# EAGLE schematic 96Boards-IoT-Mezzanine (EAGLE 9.6.2)
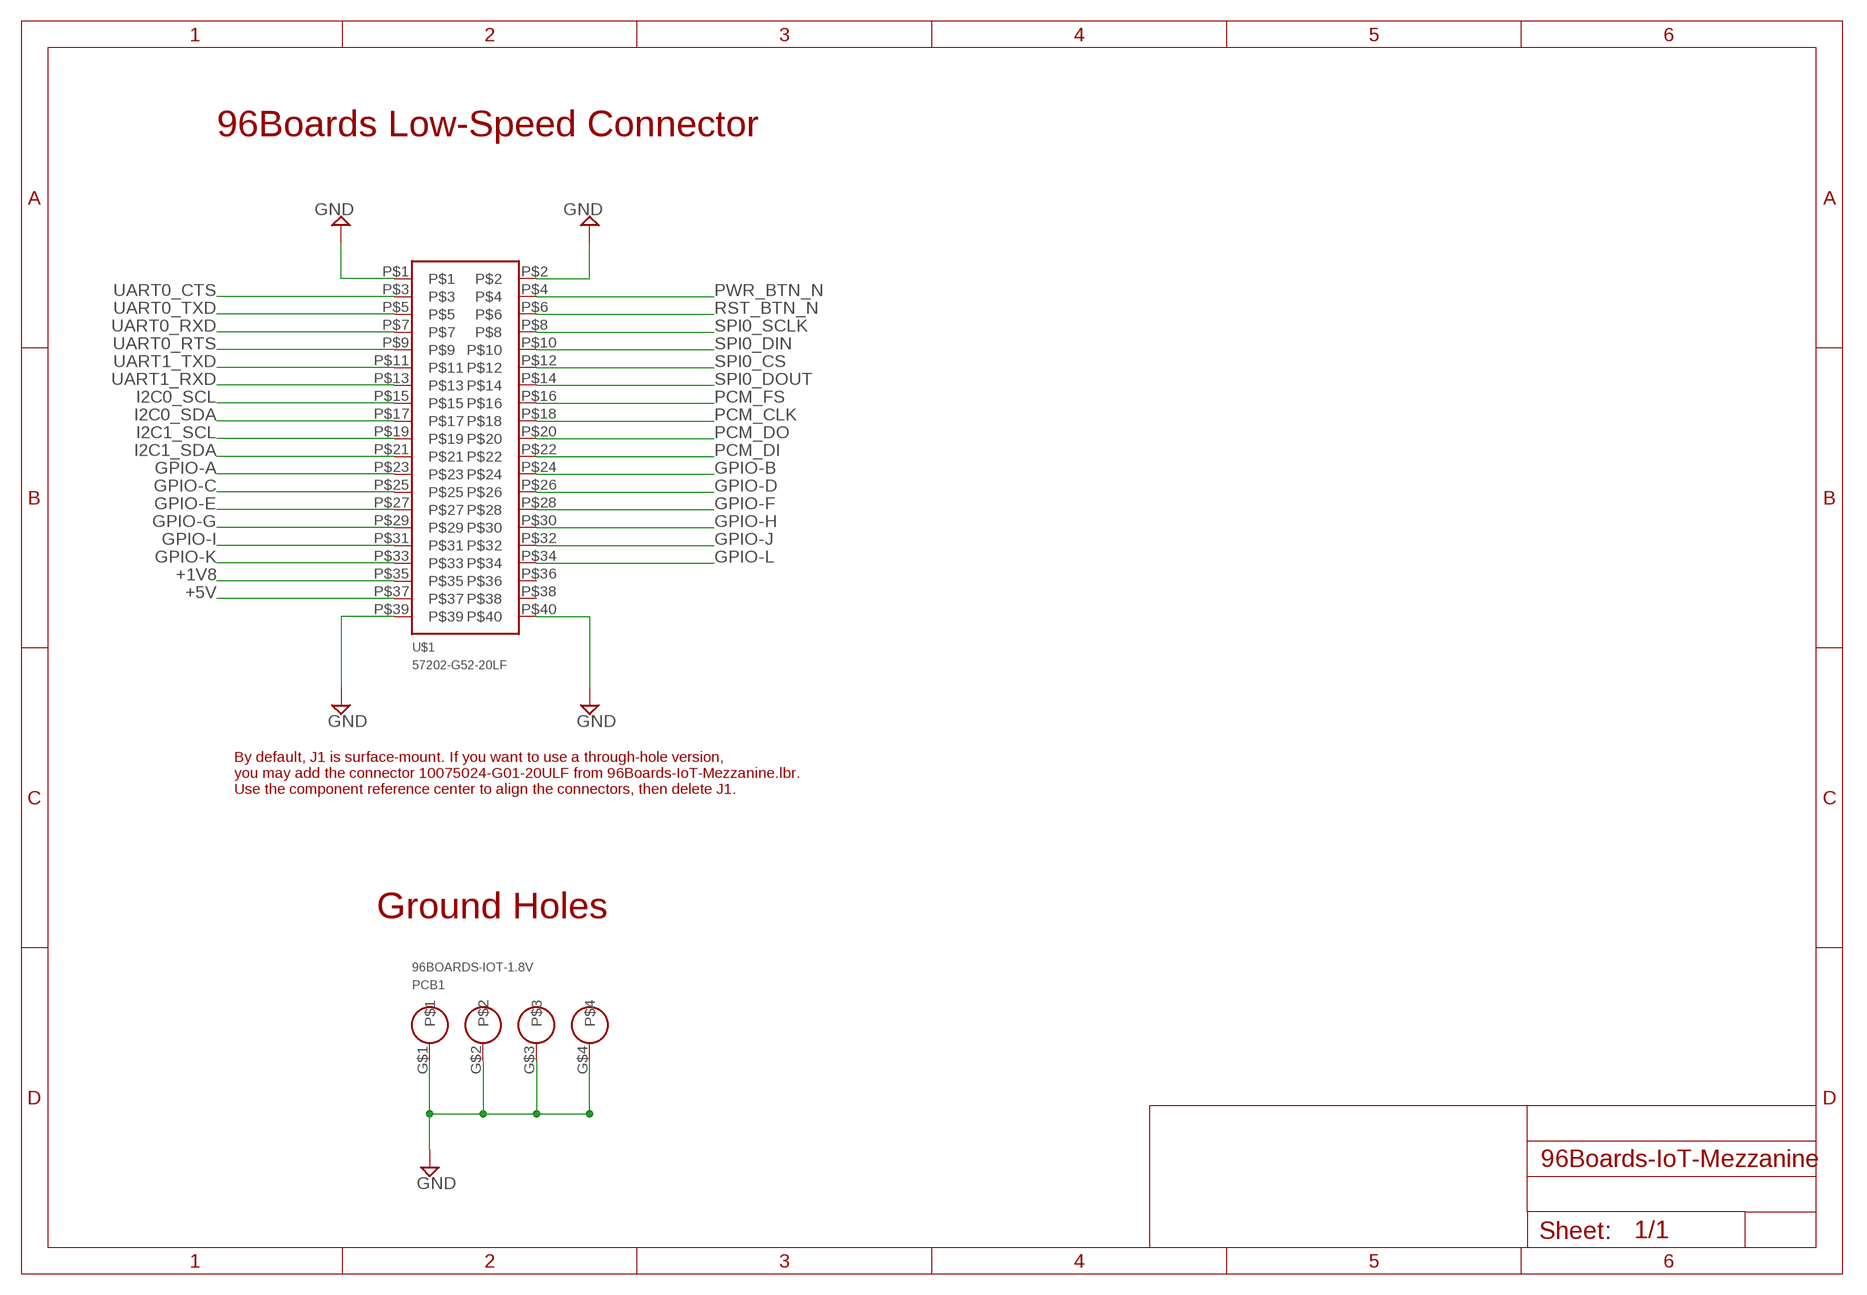
[diagram p0: schematic, sheet 1]

## Parts
PCB1  96BOARDS-IOT-1.8V  [96BOARDS-IOT-1.8V]
U$1  57202-G52-20LF  [57202-G52-20LF]

## Nets
+1V8: U$1.P$35
+5V: U$1.P$37
GND: PCB1.G$1 PCB1.G$2 PCB1.G$3 PCB1.G$4 U$1.P$1 U$1.P$2 U$1.P$39 U$1.P$40
GPIO-A: U$1.P$23
GPIO-B: U$1.P$24
GPIO-C: U$1.P$25
GPIO-D: U$1.P$26
GPIO-E: U$1.P$27
GPIO-F: U$1.P$28
GPIO-G: U$1.P$29
GPIO-H: U$1.P$30
GPIO-I: U$1.P$31
GPIO-J: U$1.P$32
GPIO-K: U$1.P$33
GPIO-L: U$1.P$34
I2C0_SCL: U$1.P$15
I2C0_SDA: U$1.P$17
I2C1_SCL: U$1.P$19
I2C1_SDA: U$1.P$21
PCM_CLK: U$1.P$18
PCM_DI: U$1.P$22
PCM_DO: U$1.P$20
PCM_FS: U$1.P$16
PWR_BTN_N: U$1.P$4
RST_BTN_N: U$1.P$6
SPI0_CS: U$1.P$12
SPI0_DIN: U$1.P$10
SPI0_DOUT: U$1.P$14
SPI0_SCLK: U$1.P$8
UART0_CTS: U$1.P$3
UART0_RTS: U$1.P$9
UART0_RXD: U$1.P$7
UART0_TXD: U$1.P$5
UART1_RXD: U$1.P$13
UART1_TXD: U$1.P$11
Unconnected: U$1.P$36 U$1.P$38

## Notes on the sheet
- 96Boards Low-Speed Connector
- By default, J1 is surface-mount. If you want to use a through-hole version, 
  you may add the connector 10075024-G01-20ULF from 96Boards-IoT-Mezzanine.lbr.
  Use the component reference center to align the connectors, then delete J1.
- Ground Holes

## Library data of the parts
PCB1 = 96Boards-IoT-Mezzanine:96BOARDS-IOT-1.8V
U$1 = 96Boards-IoT-Mezzanine:57202-G52-20LF